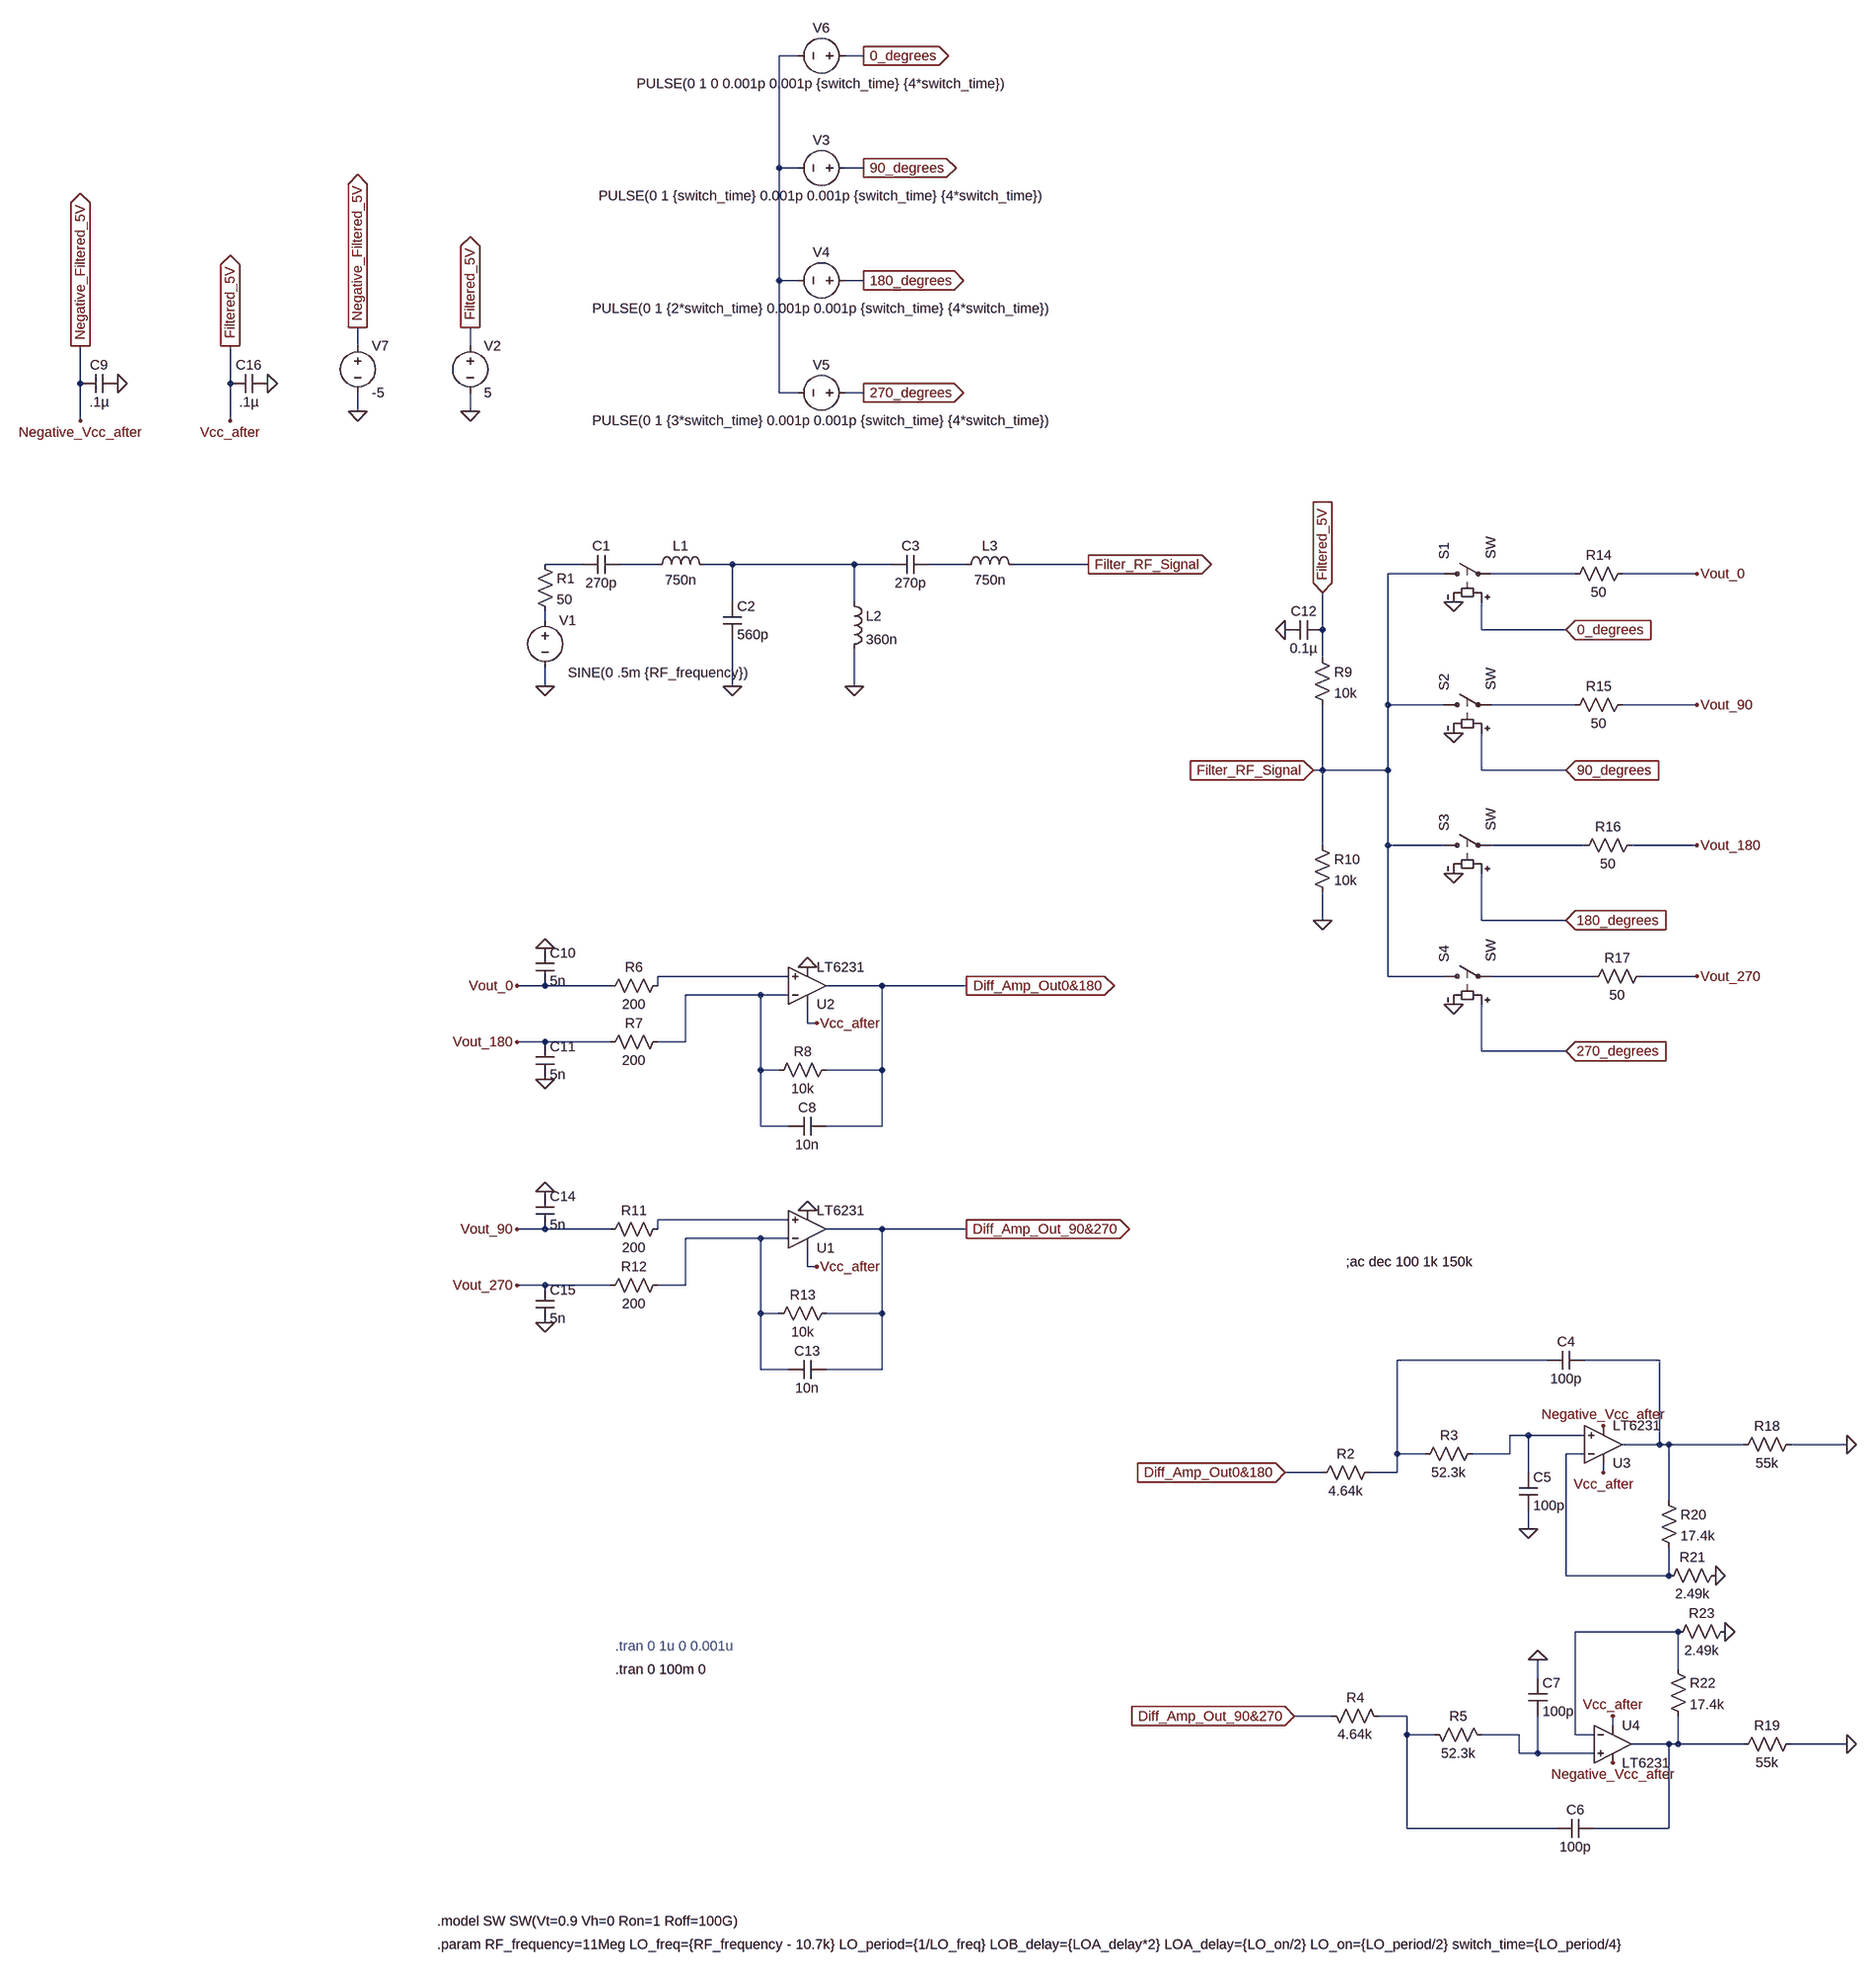
[diagram p0: schematic SDRsim v1.asc]
SDRsim v1.asc, the LTspice schematic file:
Version 4
SHEET 1 2548 2920
WIRE 320 -1040 288 -1040
WIRE 432 -1040 400 -1040
WIRE 288 -848 288 -1040
WIRE 320 -848 288 -848
WIRE 432 -848 400 -848
WIRE 288 -656 288 -848
WIRE 320 -656 288 -656
WIRE 432 -656 400 -656
WIRE -432 -544 -432 -576
WIRE -240 -544 -240 -576
WIRE -976 -480 -976 -544
WIRE -720 -480 -720 -544
WIRE 288 -464 288 -656
WIRE 320 -464 288 -464
WIRE 432 -464 400 -464
WIRE -432 -432 -432 -464
WIRE -240 -432 -240 -464
WIRE -976 -416 -976 -480
WIRE -720 -416 -720 -480
WIRE -48 -144 -112 -144
WIRE 80 -144 16 -144
WIRE 208 -144 160 -144
WIRE 416 -144 208 -144
WIRE 480 -144 416 -144
WIRE 608 -144 544 -144
WIRE 816 -144 688 -144
WIRE 1424 -128 1328 -128
WIRE 1648 -128 1504 -128
WIRE 1856 -128 1728 -128
WIRE 208 -80 208 -144
WIRE 416 -80 416 -144
WIRE -112 -48 -112 -64
WIRE 1216 -32 1216 -96
WIRE 1488 -32 1488 -80
WIRE 1632 -32 1488 -32
WIRE 1216 16 1216 -32
WIRE -112 64 -112 32
WIRE 208 64 208 -16
WIRE 416 64 416 0
WIRE 1328 96 1328 -128
WIRE 1424 96 1328 96
WIRE 1648 96 1504 96
WIRE 1856 96 1728 96
WIRE 1216 208 1216 96
WIRE 1216 208 1200 208
WIRE 1328 208 1328 96
WIRE 1328 208 1216 208
WIRE 1488 208 1488 144
WIRE 1632 208 1488 208
WIRE 1216 336 1216 208
WIRE 1328 336 1328 208
WIRE 1424 336 1328 336
WIRE 1664 336 1504 336
WIRE 1856 336 1744 336
WIRE 1216 464 1216 416
WIRE 1488 464 1488 384
WIRE 1632 464 1488 464
WIRE 304 560 80 560
WIRE 1328 560 1328 336
WIRE 1424 560 1328 560
WIRE 1680 560 1504 560
WIRE 1856 560 1760 560
WIRE -112 576 -160 576
WIRE 0 576 -112 576
WIRE 80 576 80 560
WIRE 464 576 368 576
WIRE 608 576 464 576
WIRE 256 592 128 592
WIRE 304 592 256 592
WIRE 336 640 336 608
WIRE 352 640 336 640
WIRE -112 672 -160 672
WIRE 0 672 -112 672
WIRE 128 672 128 592
WIRE 128 672 80 672
WIRE 1488 688 1488 608
WIRE 1632 688 1488 688
WIRE 256 720 256 592
WIRE 288 720 256 720
WIRE 464 720 464 576
WIRE 464 720 368 720
WIRE 256 816 256 720
WIRE 304 816 256 816
WIRE 464 816 464 720
WIRE 464 816 368 816
WIRE 304 976 80 976
WIRE -112 992 -160 992
WIRE 0 992 -112 992
WIRE 80 992 80 976
WIRE 464 992 368 992
WIRE 608 992 464 992
WIRE 256 1008 128 1008
WIRE 304 1008 256 1008
WIRE 336 1056 336 1024
WIRE 352 1056 336 1056
WIRE -112 1088 -160 1088
WIRE 0 1088 -112 1088
WIRE 128 1088 128 1008
WIRE 128 1088 80 1088
WIRE 256 1136 256 1008
WIRE 288 1136 256 1136
WIRE 464 1136 464 992
WIRE 464 1136 368 1136
WIRE 1600 1216 1344 1216
WIRE 1792 1216 1664 1216
WIRE 256 1232 256 1136
WIRE 304 1232 256 1232
WIRE 464 1232 464 1136
WIRE 464 1232 368 1232
WIRE 1568 1344 1536 1344
WIRE 1664 1344 1568 1344
WIRE 1792 1360 1792 1216
WIRE 1792 1360 1728 1360
WIRE 1808 1360 1792 1360
WIRE 1936 1360 1808 1360
WIRE 2112 1360 2016 1360
WIRE 1344 1376 1344 1216
WIRE 1392 1376 1344 1376
WIRE 1536 1376 1536 1344
WIRE 1536 1376 1472 1376
WIRE 1664 1376 1632 1376
WIRE 1216 1408 1152 1408
WIRE 1344 1408 1344 1376
WIRE 1344 1408 1296 1408
WIRE 1568 1408 1568 1344
WIRE 1696 1408 1696 1392
WIRE 1808 1456 1808 1360
WIRE 1568 1504 1568 1472
WIRE 1632 1584 1632 1376
WIRE 1808 1584 1808 1536
WIRE 1808 1584 1632 1584
WIRE 1824 1680 1648 1680
WIRE 1824 1744 1824 1680
WIRE 1584 1760 1584 1728
WIRE 1232 1824 1168 1824
WIRE 1360 1824 1312 1824
WIRE 1712 1840 1712 1824
WIRE 1360 1856 1360 1824
WIRE 1408 1856 1360 1856
WIRE 1552 1856 1488 1856
WIRE 1648 1856 1648 1680
WIRE 1680 1856 1648 1856
WIRE 1808 1872 1744 1872
WIRE 1824 1872 1824 1824
WIRE 1824 1872 1808 1872
WIRE 1936 1872 1824 1872
WIRE 2112 1872 2016 1872
WIRE 1552 1888 1552 1856
WIRE 1584 1888 1584 1824
WIRE 1584 1888 1552 1888
WIRE 1680 1888 1584 1888
WIRE 1360 2016 1360 1856
WIRE 1616 2016 1360 2016
WIRE 1808 2016 1808 1872
WIRE 1808 2016 1680 2016
FLAG -112 64 0
FLAG 208 64 0
FLAG 416 64 0
FLAG 1568 1504 0
FLAG 1584 1728 0
FLAG -912 -480 0
FLAG 336 544 0
FLAG -112 512 0
FLAG -112 736 0
FLAG 816 -144 Filter_RF_Signal
IOPIN 816 -144 Out
FLAG 1440 -80 0
FLAG 1440 144 0
FLAG 1440 384 0
FLAG 1440 608 0
FLAG 1200 208 Filter_RF_Signal
IOPIN 1200 208 In
FLAG 1152 -32 0
FLAG 1216 464 0
FLAG -240 -432 0
FLAG -240 -576 Filtered_5V
IOPIN -240 -576 Out
FLAG 1216 -96 Filtered_5V
IOPIN 1216 -96 In
FLAG 432 -1040 0_degrees
IOPIN 432 -1040 Out
FLAG 432 -848 90_degrees
IOPIN 432 -848 Out
FLAG 432 -656 180_degrees
IOPIN 432 -656 Out
FLAG 432 -464 270_degrees
IOPIN 432 -464 Out
FLAG 1632 -32 0_degrees
IOPIN 1632 -32 In
FLAG 1632 208 90_degrees
IOPIN 1632 208 In
FLAG 1632 464 180_degrees
IOPIN 1632 464 In
FLAG 1632 688 270_degrees
IOPIN 1632 688 In
FLAG -976 -416 Negative_Vcc_after
FLAG 336 960 0
FLAG -112 928 0
FLAG -112 1152 0
FLAG 1856 -128 Vout_0
FLAG -160 576 Vout_0
FLAG 1856 96 Vout_90
FLAG -160 992 Vout_90
FLAG 1856 336 Vout_180
FLAG -160 672 Vout_180
FLAG 1856 560 Vout_270
FLAG -160 1088 Vout_270
FLAG -976 -544 Negative_Filtered_5V
IOPIN -976 -544 Out
FLAG 352 640 Vcc_after
FLAG 352 1056 Vcc_after
FLAG 1696 1408 Vcc_after
FLAG 1712 1824 Vcc_after
FLAG 608 992 Diff_Amp_Out_90&270
IOPIN 608 992 Out
FLAG 1168 1824 Diff_Amp_Out_90&270
IOPIN 1168 1824 In
FLAG 608 576 Diff_Amp_Out0&180
IOPIN 608 576 Out
FLAG 1152 1408 Diff_Amp_Out0&180
IOPIN 1152 1408 In
FLAG 2112 1360 0
FLAG 2112 1872 0
FLAG 1888 1584 0
FLAG 1904 1680 0
FLAG -432 -432 0
FLAG -432 -576 Negative_Filtered_5V
IOPIN -432 -576 Out
FLAG -656 -480 0
FLAG -720 -416 Vcc_after
FLAG -720 -544 Filtered_5V
IOPIN -720 -544 Out
FLAG 1696 1328 Negative_Vcc_after
FLAG 1712 1904 Negative_Vcc_after
SYMBOL voltage -112 -64 R0
WINDOW 123 40 48 Left 2
WINDOW 39 39 77 Left 2
WINDOW 3 39 105 Left 2
SYMATTR Value SINE(0 .5m {RF_frequency})
SYMATTR InstName V1
SYMBOL cap -48 -128 R270
WINDOW 0 32 32 VTop 2
WINDOW 3 0 32 VBottom 2
SYMATTR InstName C1
SYMATTR Value 270p
SYMBOL ind 64 -128 R270
WINDOW 0 32 56 VTop 2
WINDOW 3 5 56 VBottom 2
SYMATTR InstName L1
SYMATTR Value 750n
SYMBOL cap 192 -80 R0
SYMATTR InstName C2
SYMATTR Value 560p
SYMBOL ind 400 -96 R0
SYMATTR InstName L2
SYMATTR Value 360n
SYMBOL cap 480 -128 R270
WINDOW 0 32 32 VTop 2
WINDOW 3 0 32 VBottom 2
SYMATTR InstName C3
SYMATTR Value 270p
SYMBOL ind 592 -128 R270
WINDOW 0 32 56 VTop 2
WINDOW 3 5 56 VBottom 2
SYMATTR InstName L3
SYMATTR Value 750n
SYMBOL res -128 -160 R0
SYMATTR InstName R1
SYMATTR Value 50
SYMBOL res 1312 1392 R90
WINDOW 0 0 56 VBottom 2
WINDOW 3 32 56 VTop 2
SYMATTR InstName R2
SYMATTR Value 4.64k
SYMBOL res 1488 1360 R90
WINDOW 0 0 56 VBottom 2
WINDOW 3 32 56 VTop 2
SYMATTR InstName R3
SYMATTR Value 52.3k
SYMBOL cap 1664 1200 R90
WINDOW 0 0 32 VBottom 2
WINDOW 3 32 32 VTop 2
SYMATTR InstName C4
SYMATTR Value 100p
SYMBOL cap 1552 1408 R0
SYMATTR InstName C5
SYMATTR Value 100p
SYMBOL res 1328 1840 M270
WINDOW 0 32 56 VTop 2
WINDOW 3 0 56 VBottom 2
SYMATTR InstName R4
SYMATTR Value 4.64k
SYMBOL res 1504 1872 M270
WINDOW 0 32 56 VTop 2
WINDOW 3 0 56 VBottom 2
SYMATTR InstName R5
SYMATTR Value 52.3k
SYMBOL cap 1680 2032 M270
WINDOW 0 32 32 VTop 2
WINDOW 3 0 32 VBottom 2
SYMATTR InstName C6
SYMATTR Value 100p
SYMBOL cap 1568 1824 M180
WINDOW 0 24 56 Left 2
WINDOW 3 24 8 Left 2
SYMATTR InstName C7
SYMATTR Value 100p
SYMBOL sw 1408 -128 R270
SYMATTR InstName S1
SYMBOL sw 1408 96 R270
SYMATTR InstName S2
SYMBOL sw 1408 336 R270
SYMATTR InstName S3
SYMBOL sw 1408 560 R270
SYMATTR InstName S4
SYMBOL res 96 560 R90
WINDOW 0 0 56 VBottom 2
WINDOW 3 32 56 VTop 2
SYMATTR InstName R6
SYMATTR Value 200
SYMBOL res 96 656 R90
WINDOW 0 0 56 VBottom 2
WINDOW 3 32 56 VTop 2
SYMATTR InstName R7
SYMATTR Value 200
SYMBOL res 384 704 R90
WINDOW 0 0 56 VBottom 2
WINDOW 3 32 56 VTop 2
SYMATTR InstName R8
SYMATTR Value 10k
SYMBOL cap 368 800 R90
WINDOW 0 0 32 VBottom 2
WINDOW 3 32 32 VTop 2
SYMATTR InstName C8
SYMATTR Value 10n
SYMBOL cap -912 -496 R90
WINDOW 0 0 32 VBottom 2
WINDOW 3 32 32 VTop 2
SYMATTR InstName C9
SYMATTR Value .1µ
SYMBOL cap -128 512 R0
SYMATTR InstName C10
SYMATTR Value 5n
SYMBOL cap -128 672 R0
SYMATTR InstName C11
SYMATTR Value 5n
SYMBOL res 1200 0 R0
SYMATTR InstName R9
SYMATTR Value 10k
SYMBOL res 1200 320 R0
SYMATTR InstName R10
SYMATTR Value 10k
SYMBOL cap 1216 -48 R90
WINDOW 0 0 32 VBottom 2
WINDOW 3 32 32 VTop 2
SYMATTR InstName C12
SYMATTR Value 0.1µ
SYMBOL voltage -240 -560 R0
WINDOW 123 0 0 Left 0
WINDOW 39 0 0 Left 0
SYMATTR InstName V2
SYMATTR Value 5
SYMBOL voltage 416 -848 R90
WINDOW 0 -32 56 VBottom 2
WINDOW 3 32 56 VTop 2
WINDOW 123 0 0 Left 0
WINDOW 39 0 0 Left 0
SYMATTR InstName V3
SYMATTR Value PULSE(0 1 {switch_time} 0.001p 0.001p {switch_time} {4*switch_time})
SYMBOL voltage 416 -656 R90
WINDOW 0 -32 56 VBottom 2
WINDOW 3 32 56 VTop 2
WINDOW 123 0 0 Left 0
WINDOW 39 0 0 Left 0
SYMATTR InstName V4
SYMATTR Value PULSE(0 1 {2*switch_time} 0.001p 0.001p {switch_time} {4*switch_time})
SYMBOL voltage 416 -464 R90
WINDOW 0 -32 56 VBottom 2
WINDOW 3 32 56 VTop 2
WINDOW 123 0 0 Left 0
WINDOW 39 0 0 Left 0
SYMATTR InstName V5
SYMATTR Value PULSE(0 1 {3*switch_time} 0.001p 0.001p {switch_time} {4*switch_time})
SYMBOL res 96 976 R90
WINDOW 0 0 56 VBottom 2
WINDOW 3 32 56 VTop 2
SYMATTR InstName R11
SYMATTR Value 200
SYMBOL res 96 1072 R90
WINDOW 0 0 56 VBottom 2
WINDOW 3 32 56 VTop 2
SYMATTR InstName R12
SYMATTR Value 200
SYMBOL res 384 1120 R90
WINDOW 0 0 56 VBottom 2
WINDOW 3 32 56 VTop 2
SYMATTR InstName R13
SYMATTR Value 10k
SYMBOL cap 368 1216 R90
WINDOW 0 0 32 VBottom 2
WINDOW 3 32 32 VTop 2
SYMATTR InstName C13
SYMATTR Value 10n
SYMBOL cap -128 928 R0
SYMATTR InstName C14
SYMATTR Value 5n
SYMBOL cap -128 1088 R0
SYMATTR InstName C15
SYMATTR Value 5n
SYMBOL voltage 416 -1040 R90
WINDOW 0 -32 56 VBottom 2
WINDOW 3 32 56 VTop 2
WINDOW 123 0 0 Left 0
WINDOW 39 0 0 Left 0
SYMATTR InstName V6
SYMATTR Value PULSE(0 1 0 0.001p 0.001p {switch_time} {4*switch_time})
SYMBOL OpAmps\\LT6231 336 992 M180
SYMATTR InstName U1
SYMBOL OpAmps\\LT6231 336 576 M180
SYMATTR InstName U2
SYMBOL OpAmps\\LT6231 1696 1360 M180
SYMATTR InstName U3
SYMBOL OpAmps\\LT6231 1712 1872 R0
SYMATTR InstName U4
SYMBOL res 1744 -144 R90
WINDOW 0 0 56 VBottom 2
WINDOW 3 32 56 VTop 2
SYMATTR InstName R14
SYMATTR Value 50
SYMBOL res 1744 80 R90
WINDOW 0 0 56 VBottom 2
WINDOW 3 32 56 VTop 2
SYMATTR InstName R15
SYMATTR Value 50
SYMBOL res 1760 320 R90
WINDOW 0 0 56 VBottom 2
WINDOW 3 32 56 VTop 2
SYMATTR InstName R16
SYMATTR Value 50
SYMBOL res 1776 544 R90
WINDOW 0 0 56 VBottom 2
WINDOW 3 32 56 VTop 2
SYMATTR InstName R17
SYMATTR Value 50
SYMBOL res 2032 1344 R90
WINDOW 0 0 56 VBottom 2
WINDOW 3 32 56 VTop 2
SYMATTR InstName R18
SYMATTR Value 55k
SYMBOL res 2032 1856 R90
WINDOW 0 0 56 VBottom 2
WINDOW 3 32 56 VTop 2
SYMATTR InstName R19
SYMATTR Value 55k
SYMBOL res 1792 1440 R0
SYMATTR InstName R20
SYMATTR Value 17.4k
SYMBOL res 1904 1568 R90
WINDOW 0 0 56 VBottom 2
WINDOW 3 32 56 VTop 2
SYMATTR InstName R21
SYMATTR Value 2.49k
SYMBOL res 1808 1728 R0
SYMATTR InstName R22
SYMATTR Value 17.4k
SYMBOL res 1920 1664 R90
WINDOW 0 0 56 VBottom 2
WINDOW 3 32 56 VTop 2
SYMATTR InstName R23
SYMATTR Value 2.49k
SYMBOL voltage -432 -560 R0
WINDOW 123 0 0 Left 0
WINDOW 39 0 0 Left 0
SYMATTR InstName V7
SYMATTR Value -5
SYMBOL cap -656 -496 R90
WINDOW 0 0 32 VBottom 2
WINDOW 3 32 32 VTop 2
SYMATTR InstName C16
SYMATTR Value .1µ
TEXT 1256 1048 Left 2 !;ac dec 100 1k 150k
TEXT -296 2368 Left 2 !.model SW SW(Vt=0.9 Vh=0 Ron=1 Roff=100G)
TEXT -296 2408 Left 2 !.param RF_frequency=11Meg LO_freq={RF_frequency - 10.7k} LO_period={1/LO_freq} LOB_delay={LOA_delay*2} LOA_delay={LO_on/2} LO_on={LO_period/2} switch_time={LO_period/4}
TEXT 8 1744 Left 2 !.tran 0 100m 0
TEXT 8 1704 Left 2 ;.tran 0 1u 0 0.001u

The netlist it stands for:
* SDRsim v1.asc
V1 N007 0 SINE(0 .5m {RF_frequency})
C1 N002 N003 270p
L1 N003 N004 750n
C2 N004 0 560p
L2 N004 0 360n
C3 N004 N005 270p
L3 N005 Filter_RF_Signal 750n
R1 N002 N007 50
R2 N015 Diff_Amp_Out0&180 4.64k
R3 N017 N015 52.3k
C4 N016 N015 100p
C5 N017 0 100p
R4 N020 Diff_Amp_Out_90&270 4.64k
R5 N021 N020 52.3k
C6 N022 N020 100p
C7 N021 0 100p
S1 Filter_RF_Signal N006 0_degrees 0 SW
S2 Filter_RF_Signal N008 90_degrees 0 SW
S3 Filter_RF_Signal N009 180_degrees 0 SW
S4 Filter_RF_Signal N011 270_degrees 0 SW
R6 N010 Vout_0 200
R7 N012 Vout_180 200
R8 Diff_Amp_Out0&180 N012 10k
C8 Diff_Amp_Out0&180 N012 10n
C9 0 Negative_Filtered_5V .1µ
C10 0 Vout_0 5n
C11 Vout_180 0 5n
R9 Vcc_after Filter_RF_Signal 10k
R10 Filter_RF_Signal 0 10k
C12 Vcc_after 0 0.1µ
V2 Vcc_after 0 5
V3 90_degrees N001 PULSE(0 1 {switch_time} 0.001p 0.001p {switch_time} {4*switch_time})
V4 180_degrees N001 PULSE(0 1 {2*switch_time} 0.001p 0.001p {switch_time} {4*switch_time})
V5 270_degrees N001 PULSE(0 1 {3*switch_time} 0.001p 0.001p {switch_time} {4*switch_time})
R11 N013 Vout_90 200
R12 N014 Vout_270 200
R13 Diff_Amp_Out_90&270 N014 10k
C13 Diff_Amp_Out_90&270 N014 10n
C14 0 Vout_90 5n
C15 Vout_270 0 5n
V6 0_degrees N001 PULSE(0 1 0 0.001p 0.001p {switch_time} {4*switch_time})
XU1 N013 N014 Diff_Amp_Out_90&270 Vcc_after 0 LT6231  ; pins In+ In- OUT V+ V-
XU2 N010 N012 Diff_Amp_Out0&180 Vcc_after 0 LT6231  ; pins In+ In- OUT V+ V-
XU3 N017 N018 N016 Vcc_after Negative_Filtered_5V LT6231  ; pins In+ In- OUT V+ V-
XU4 N021 N019 N022 Vcc_after Negative_Filtered_5V LT6231  ; pins In+ In- OUT V+ V-
R14 Vout_0 N006 50
R15 Vout_90 N008 50
R16 Vout_180 N009 50
R17 Vout_270 N011 50
R18 0 N016 55k
R19 0 N022 55k
R20 N016 N018 17.4k
R21 0 N018 2.49k
R22 N019 N022 17.4k
R23 0 N019 2.49k
V7 Negative_Filtered_5V 0 -5
C16 0 Vcc_after .1µ
;ac dec 100 1k 150k
.model SW SW(Vt=0.9 Vh=0 Ron=1 Roff=100G)
.param RF_frequency=11Meg LO_freq={RF_frequency - 10.7k} LO_period={1/LO_freq} LOB_delay={LOA_delay*2} LOA_delay={LO_on/2} LO_on={LO_period/2} switch_time={LO_period/4}
.tran 0 100m 0
* .tran 0 1u 0 0.001u
.lib LTC2.lib
.backanno
.end